# EAGLE design echo-hello-world-plus-0p3 (EAGLE 9.2.0)
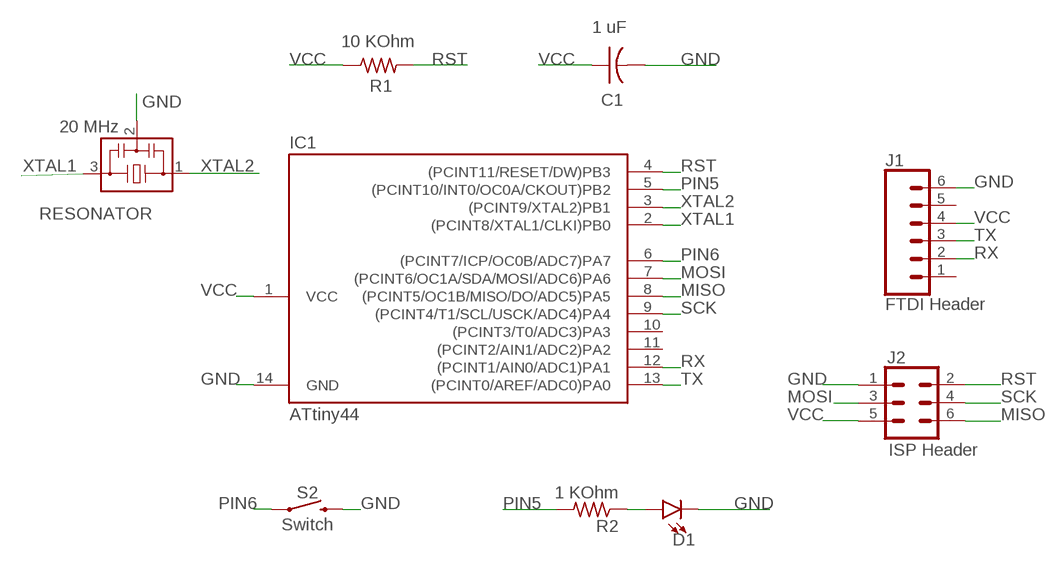
[diagram p0: schematic, sheet 1]

## Parts
C1  1 uF  C-USC1206  [C1206]
D1  LED1206  [LED-1206]
IC1  ATtiny44  ATTINY44-SSU  [SOIC14]
J1  FTDI Header  CONN_06SMD_MALE  [1X06_SMD_MALE]
J2  ISP Header  CONN_03X2FEMALE_SMD  [2X3_SMD]
R1  10 KOhm  R-US_R1206  [R1206]
R2  1 KOhm  R-US_M1206  [M1206]
RESONATOR  20 MHz  RESONATOR  [EFOBM]
S2  Switch  MOMENTARY-SWITCH-SPST-SMD-6.2MM-TALL  [TACTILE_SWITCH_SMD_6.2MM_TALL]

## Nets
GND: C1.2 D1.C IC1.14(GND) J1.6 J2.1 RESONATOR.2 S2.B2
MISO: IC1.8((PCINT5/OC1B/MISO/DO/ADC5)PA5) J2.6
MOSI: IC1.7((PCINT6/OC1A/SDA/MOSI/ADC6)PA6) J2.3
N$13: D1.A R2.1
PIN5: IC1.5((PCINT10/INT0/OC0A/CKOUT)PB2) R2.2
PIN6: IC1.6((PCINT7/ICP/OC0B/ADC7)PA7) S2.A2
RST: IC1.4((PCINT11/RESET/DW)PB3) J2.2 R1.2
RX: IC1.12((PCINT1/AIN0/ADC1)PA1) J1.2
SCK: IC1.9((PCINT4/T1/SCL/USCK/ADC4)PA4) J2.4
TX: IC1.13((PCINT0/AREF/ADC0)PA0) J1.3
VCC: C1.1 IC1.1(VCC) J1.4 J2.5 R1.1
XTAL1: IC1.2((PCINT8/XTAL1/CLKI)PB0) RESONATOR.3
XTAL2: IC1.3((PCINT9/XTAL2)PB1) RESONATOR.1
Unconnected: IC1.10((PCINT3/T0/ADC3)PA3) IC1.11((PCINT2/AIN1/ADC2)PA2) J1.1 J1.5

## Library data of the parts
C1 = rcl:C-US: CAPACITOR, American symbol; SPICEPREFIX: C
D1 = SparkFun-LED:LED: LED (Generic) Standard schematic elements and footprints for 5mm, 3mm, 1206, and 0603 sized LEDs. Generic LEDs with no color specified.
IC1 = fab:ATTINY44
J1 = SparkFun-Connectors:CONN_06: Multi connection point. Often used as Generic Header-pin footprint for 0.1 inch spaced/style header connections On any of the 0.1 inch spaced packages, you can populate with these: Break Away Headers - Straight <https://www.sparkfun.com/products/116> (PRT-00116) Break Away Male Headers - Right Angle <https://www.sparkfun.com/products/553> (PRT-00553) Female Headers <https://www.sparkfun.com/products/115> (PRT-00115) Break Away Headers - Machine Pin <https://www.sparkfun.com/products/117> (PRT-00117) Break Away Female Headers - Swiss Machine Pin <https://www.sparkfun.com/products/743> (PRT-00743) Arduino Stackable Header - 6 Pin <https://www.sparkfun.com/products/9280> (PRT-09280) For SCREWTERMINALS and SPRING TERMINALS visit here: Screw Terimnals on SparkFun.com <https://www.sparkfun.com/search/results?term=Screw+Terminals> (5mm/3.5mm/2.54mm spacing) This device is also useful as a general connection point to wire up your design to another part of your project. Our various solder wires solder well into these plated through hole pads. Hook-Up Wire - Assortment (Stranded, 22 AWG) <https://www.sparkfun.com/products/11375> (PRT-11375) Hook-Up Wire - Assortment (Solid Core, 22 AWG) <https://www.sparkfun.com/products/11367> (PRT-11367) View the entire wire category on our website here <https://www.sparkfun.com/categories/141>; PROD_ID: CONN-11293
J2 = SparkFun-Connectors:CONN_03X2: Multi connection point. Often used as Generic Header-pin footprint for 0.1 inch spaced/style header connections You can populate with any combo of single row headers, but if you'd like an exact match, check these: Header - 2x3 (Male, 0.1") <https://www.sparkfun.com/products/12807> (PRT-12807) Header - 2x3 (Female, 0.1") <https://www.sparkfun.com/products/13010> (PRT-13010) 2x3 Pin Shrouded Header <https://www.sparkfun.com/products/10877> (PRT-10877) On any of the 0.1 inch spaced packages, you can populate with these: Break Away Headers - Straight <https://www.sparkfun.com/products/116> (PRT-00116) Break Away Male Headers - Right Angle <https://www.sparkfun.com/products/553> (PRT-00553) Female Headers <https://www.sparkfun.com/products/115> (PRT-00115) Break Away Headers - Machine Pin <https://www.sparkfun.com/products/117> (PRT-00117) Break Away Female Headers - Swiss Machine Pin <https://www.sparkfun.com/products/743> (PRT-00743) Special note: the shrouded connector mates well with our 3x2 ribbon cables: Ribbon Crimp Connector - 6-pin (2x3, Female) <https://www.sparkfun.com/products/10651> (PRT-10651) Ribbon Cable - 6 wire (15ft) <https://www.sparkfun.com/products/10646> (PRT-10646); PROD_ID: CONN-11290
R1 = rcl:R-US_: RESISTOR, American symbol; SPICEPREFIX: R
R2 = resistor:R-US_: RESISTOR, American symbol
RESONATOR = fab:RESONATOR
S2 = SparkFun-Switches:MOMENTARY-SWITCH-SPST: Momentary Switch (Pushbutton) - SPST Normally-open (NO) SPST momentary switches (buttons, pushbuttons). Variants PTH-12MM - 12mm square, through-hole Momentary Pushbutton Switch - 12mm Square <https://www.sparkfun.com/products/9190> (COM-09190) PTH-6.0MM, PTH-6.0MM-KIT - 6.0mm square, through-hole Mini Pushbutton Switch <https://www.sparkfun.com/products/97> (COM-00097) KIT package intended for soldering kit's - only one side of pads' copper is exposed. PTH-RIGHT-ANGLE-KIT - Right-angle, through-hole Right Angle Tactile Button <https://www.sparkfun.com/products/10791> - Used on SparkFun BigTime Watch Kit <https://www.sparkfun.com/products/11734> SMD-12MM - 12mm square, surface-mount Tactile Button - SMD (12mm) <https://www.sparkfun.com/products/12993> (COM-12993) Used on SparkFun PicoBoard <https://www.sparkfun.com/products/11888> SMD-4.5MM - 4.5mm Square Trackball Switch Used on SparkFun Blackberry Trackballer Breakout <https://www.sparkfun.com/products/13169> SMD-4.6MMX2.8MM - 4.60mm x 2.80mm, surface mount Used on SparkFun SAMD21 Mini Breakout <https://www.sparkfun.com/products/13664> SMD-5.2MM, SMD-5.2-REDUNDANT - 5.2mm square, surface-mount Mini Pushbutton Switch - SMD <https://www.sparkfun.com/products/8720> (COM-08720) Used on Arduino Pro Mini <https://www.sparkfun.com/products/11114> REDUNDANT package connects both switch circuits together SMD-6.0X3.5MM - 6.0 x 3.5mm, surface mount Momentary Reset Switch SMD <https://www.sparkfun.com/products/8229> (COM-08229) SMD-6.2MM-TALL - 6.2mm square, surface mount Tactile Button - SMD (6mm) <https://www.sparkfun.com/products/12992> Used on SparkFun Digital Sandbox <https://www.sparkfun.com/products/12651> SMD-RIGHT-ANGLE - Right-angle, surface mount Used on SparkFun Block for Intel® Edison - Arduino <https://www.sparkfun.com/products/13036>; PROD_ID: SWCH-11966; SF_SKU: COM-12992

## Board
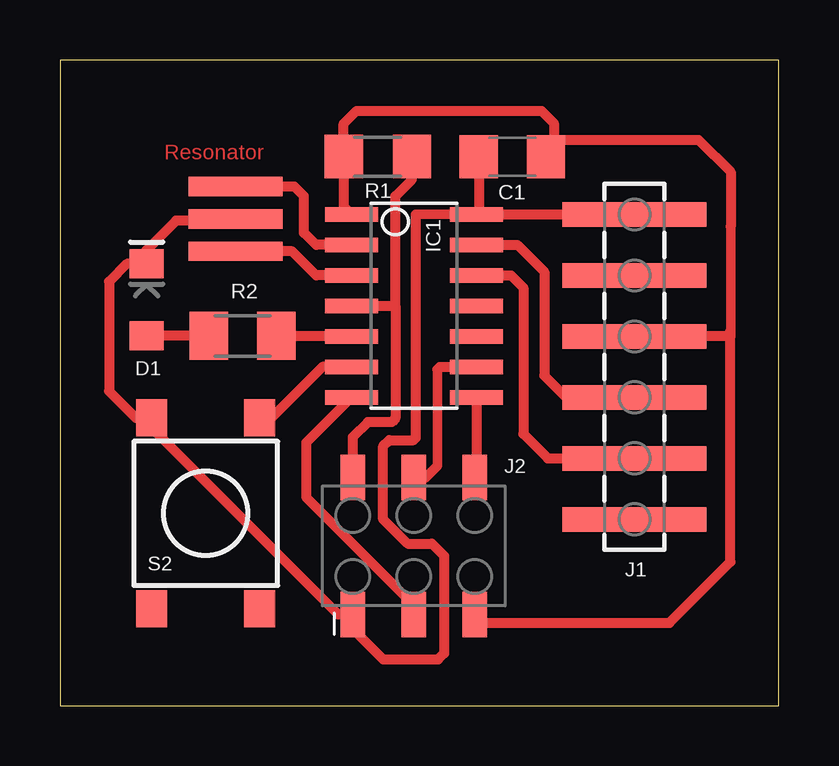
[diagram p1: board, top side]

Size 29.96 x 26.9 mm. Coordinates in mm from the lower left corner, seen from the top.
Outline: 0,0 29.96,0 29.96,26.9 0,26.9 0,0
Copper layers (1*16): Top 0.035mm / dielectric 1.5mm / Bottom 0.035mm
Design rules "default *": minimum track width 6mil, minimum drill 0.35mm, track to track 0.3mm, track to pad 0.3mm, pad to pad 0.3mm, via to via 0.3mm, smd to smd 0.3mm, copper to edge 40mil, drill to drill 6mil, minimum pad ring 10mil, minimum via ring 8mil, stop-mask expansion 4mil, vias tented up to drill 0mil, thermal gap 10mil

### Footprints (pad centres in the part's own frame; a part is rotated, then mirrored left to right if it is on the bottom)
C1206 = smd 1.6 x 1.8: 1 -1.4,0; 2 1.4,0
LED-1206 = smd 1.2 x 1.4: A -1.5,0; C 1.5,0
SOIC14 = smd 0.61 x 2.21: 1 -3.81,-2.603; 2 -2.54,-2.603; 3 -1.27,-2.603; 4 0,-2.603; 5 1.27,-2.603; 6 2.54,-2.603; 7 3.81,-2.603; 8 3.81,2.603; 9 2.54,2.603; 10 1.27,2.603; 11 0,2.603; 12 -1.27,2.603; 13 -2.54,2.603; 14 -3.81,2.603
1X06_SMD_MALE = smd 1.02 x 6: 1 0,0; 2 2.54,0; 3 5.08,0; 4 7.62,0; 5 10.16,0; 6 12.7,0
2X3_SMD = smd 1.02 x 1.9: 1 -2.54,-2.85; 2 -2.54,2.85; 3 0,-2.85; 4 0,2.85; 5 2.54,-2.85; 6 2.54,2.85
R1206 = smd 1.6 x 1.803: 1 -1.422,0; 2 1.422,0
M1206 = smd 1.6 x 2: 1 -1.4,0; 2 1.4,0
EFOBM = smd 0.8 x 3.9: 1 -1.35,0; 2 0,0; 3 1.35,0
TACTILE_SWITCH_SMD_6.2MM_TALL = smd 1.55 x 1.3: A1 -3.975,-2.25; A2 3.975,-2.25; B1 -3.975,2.25; B2 3.975,2.25

### Placement (x,y rotation side)
C1  18.86,22.87 180 top
D1  3.61,16.91 90 top
IC1  14.76,16.65 270 top
J1  23.96,7.76 90 top
J2  14.75,6.65 0 top
R1  13.25,22.87 0 top
R2  7.62,15.4 0 top
RESONATOR  7.32,20.28 90 top
S2  6.08,8.01 90 top

### Tracks (layer width: path | path; a pad name or v marks a point on that pad's centre or on a via)
GND
  Top 0.4: 17.36,20.51 IC1.14 14.84,20.46 | 23.96,20.7 J1.6
  Top 0.406: J1.6 IC1.14 17.46,20.57 C1.2 | RESONATOR.2 7.26,20.21 4.84,20.21 3.61,18.98 D1.C 2.79,18.41 2.05,17.67 2.05,13.1 3.16,11.99 S2.B2 3.83,11.57 11.6,3.8 J2.1 12.21,3.19 13.48,1.92 15.76,1.92 16.02,2.18 16.02,6.24 15.51,6.75 14.49,6.75 13.48,7.76 13.48,10.81 13.73,11.07 14.75,11.07 14.84,11.15 14.84,20.46
MISO
  Top 0.406: IC1.8 17.36,9.57 J2.6
MOSI
  Top 0.4: 10.27,10.84 10.27,10.81
  Top 0.406: IC1.7 10.27,10.96 10.27,10.81 10.27,8.69 14.75,4.21 J2.3
N$13
  Top 0.406: R2.1 D1.A
PIN5
  Top 0.406: IC1.5 9.04,15.38 R2.2
PIN6
  Top 0.406: 11.19,14.11 IC1.6 10.94,14.11 8.81,11.99 S2.A2 8.49,11.83
RST
  Top 0.406: IC1.4 13.99,16.65 | 13.99,16.65 13.99,21.23 14.68,21.92 R1.2 14.68,22.72 | J2.2 12.21,11.19 12.84,11.81 13.84,11.81 13.99,11.96 13.99,16.65
RX
  Top 0.406: IC1.12 18.81,17.92 19.32,17.42 19.32,11.32 20.34,10.3 J1.2
SCK
  Top 0.4: 15.74,10 15.74,14.01
  Top 0.406: 15.74,10 15.24,9.5 J2.4 | 15.74,14.01 15.84,14.11 IC1.9
TX
  Top 0.406: IC1.13 19.07,19.19 20.19,18.07 20.19,13.75 21.1,12.84 J1.3
VCC
  Top 0.4: 27.96,20.4 27.96,19.96 27.96,15.64 27.96,15.38
  Top 0.406: 17.29,3.36 J2.5 17.64,3.45 25.42,3.45 27.96,5.99 27.96,15.63 27.96,15.64 | 27.96,15.38 J1.4 | C1.1 20.59,22.87 20.59,23.58 | 20.59,23.58 26.62,23.58 27.96,22.23 27.96,19.96 | 20.59,23.58 20.59,24.27 20.08,24.78 12.37,24.78 11.83,24.25 R1.1 11.83,20.78 IC1.1
XTAL1
  Top 0.406: IC1.2 10.68,19.19 10.18,19.7 10.18,21.23 9.78,21.63 RESONATOR.3
XTAL2
  Top 0.406: IC1.3 10.68,17.92 9.68,18.93 RESONATOR.1

### Text on the board
Top: Resonator